# EAGLE design napajeniMOB (EAGLE 6.4)
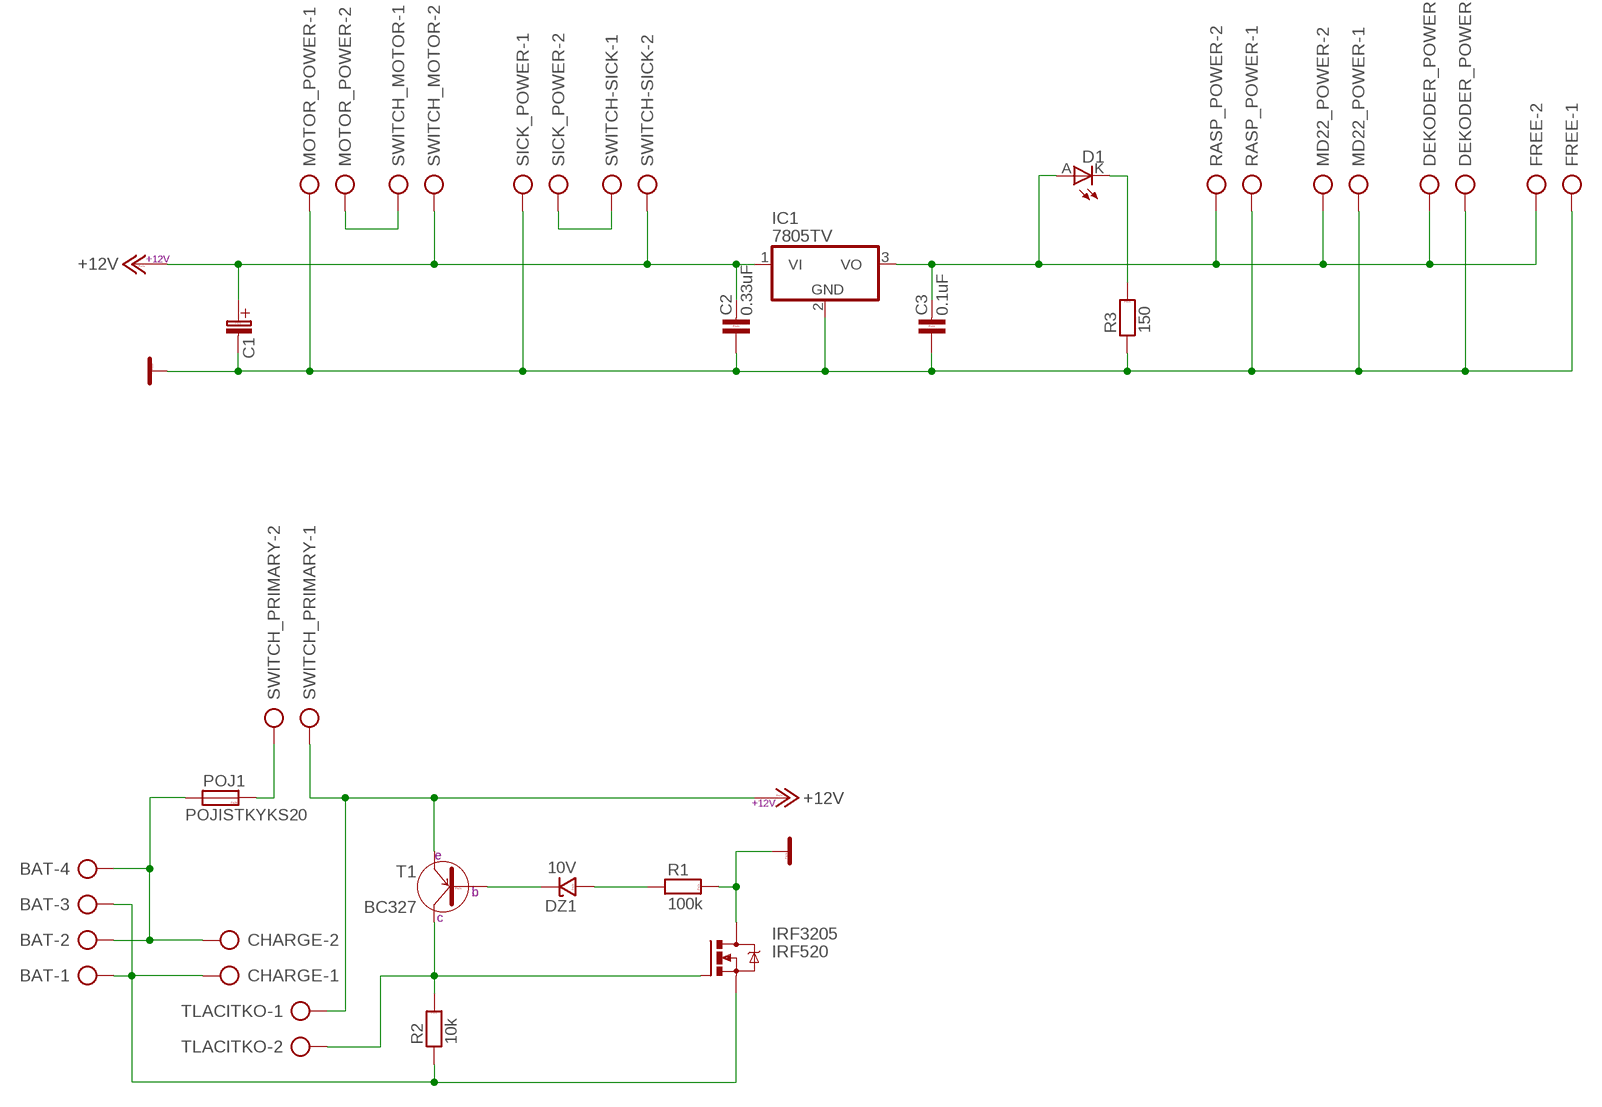
[diagram p0: schematic, sheet 1]

## Parts
BAT  AK500/4  [AK500/4]
C1  C-ELEKTROLYT_7,5+  [C-EL7,5+]
C2  0.33uF  C-KERAMIK_5  [C-5]
C3  0.1uF  C-KERAMIK_5  [C-5]
CHARGE  AK500/2  [AK500/2]
D1  LEDLED5MM  [LED5MM]
DEKODER_POWER  AK500/2  [AK500/2]
DZ1  10V  D-ZENEROVA_2W_BZY  [DO41]
FREE  AK500/2  [AK500/2]
IC1  7805TV  [TO220V]
IRF3205  IRF520  [TO220BV]
MD22_POWER  AK500/2  [AK500/2]
MOTOR_POWER  AK500/2  [AK500/2]
POJ1  POJISTKYKS20  [POJ_KS20]
R1  100k  R_10  [R-10]
R2  10k  R_10  [R-10]
R3  150  R_10  [R-10]
RASP_POWER  AK500/2  [AK500/2]
SICK_POWER  AK500/2  [AK500/2]
SWITCH-SICK  AK500/2  [AK500/2]
SWITCH_MOTOR  AK500/2  [AK500/2]
SWITCH_PRIMARY  AK500/2  [AK500/2]
T1  BC327  [TO-92]
TLACITKO  AK500/2  [AK500/2]

## Nets
+12V: C1.C+(C_EL+) C2.2 IC1.1(VI) SWITCH-SICK.2 SWITCH_MOTOR.2 SWITCH_PRIMARY.1 T1.3(E) TLACITKO.1
GND: C1.C-(C_EL-) C2.1 C3.1 DEKODER_POWER.1 FREE.1 IC1.2(GND) IRF3205.D MD22_POWER.1 MOTOR_POWER.1 R1.2 R3.1 RASP_POWER.1 SICK_POWER.1
GND_BATERIE: BAT.1 BAT.3 CHARGE.1 IRF3205.S R2.1
N$1: DZ1.A R1.1
N$2: BAT.2 BAT.4 CHARGE.2 POJ1.1
N$3: DZ1.K T1.2(B)
N$4: POJ1.2 SWITCH_PRIMARY.2
N$5: IRF3205.G R2.2 T1.1(C) TLACITKO.2
N$6: MOTOR_POWER.2 SWITCH_MOTOR.1
N$7: SICK_POWER.2 SWITCH-SICK.1
N$8: C3.2 D1.A DEKODER_POWER.2 FREE.2 IC1.3(VO) MD22_POWER.2 RASP_POWER.2
N$14: D1.K(C) R3.2

## Library data of the parts
BAT = #Svorkovnice:AK500/4: CONNECTOR
C1 = #PaJa_30:C-ELEKTROLYT: Kondenzator - elektrolyticky
C2 C3 = #PaJa_30:C-KERAMIK: Kondenzator - keramicky
CHARGE DEKODER_POWER FREE MD22_POWER MOTOR_POWER RASP_POWER SICK_POWER SWITCH-SICK SWITCH_MOTOR SWITCH_PRIMARY TLACITKO = #Svorkovnice:AK500/2: CONNECTOR
D1 = #Led:LED
DZ1 = #PaJa_30:D-ZENEROVA: Zenerova dioda
IC1 = linear:78*: Positive VOLTAGE REGULATOR Source: http://cache.national.com/ds/LM/LM78L05.pdf http://www.fairchildsemi.com/ds/LM/LM7805.pdf
IRF3205 = transistor-power:IRF520: HEXFET Power MOSFET
POJ1 = #PaJa_30:POJISTKY: Pojistkove pouzdro
R1-R3 = #PaJa_30:R: Rezistor
T1 = #PaJa_30:BC327: Tranzistor PNP - Univerzalni NF - Ic=0,5A

## Board
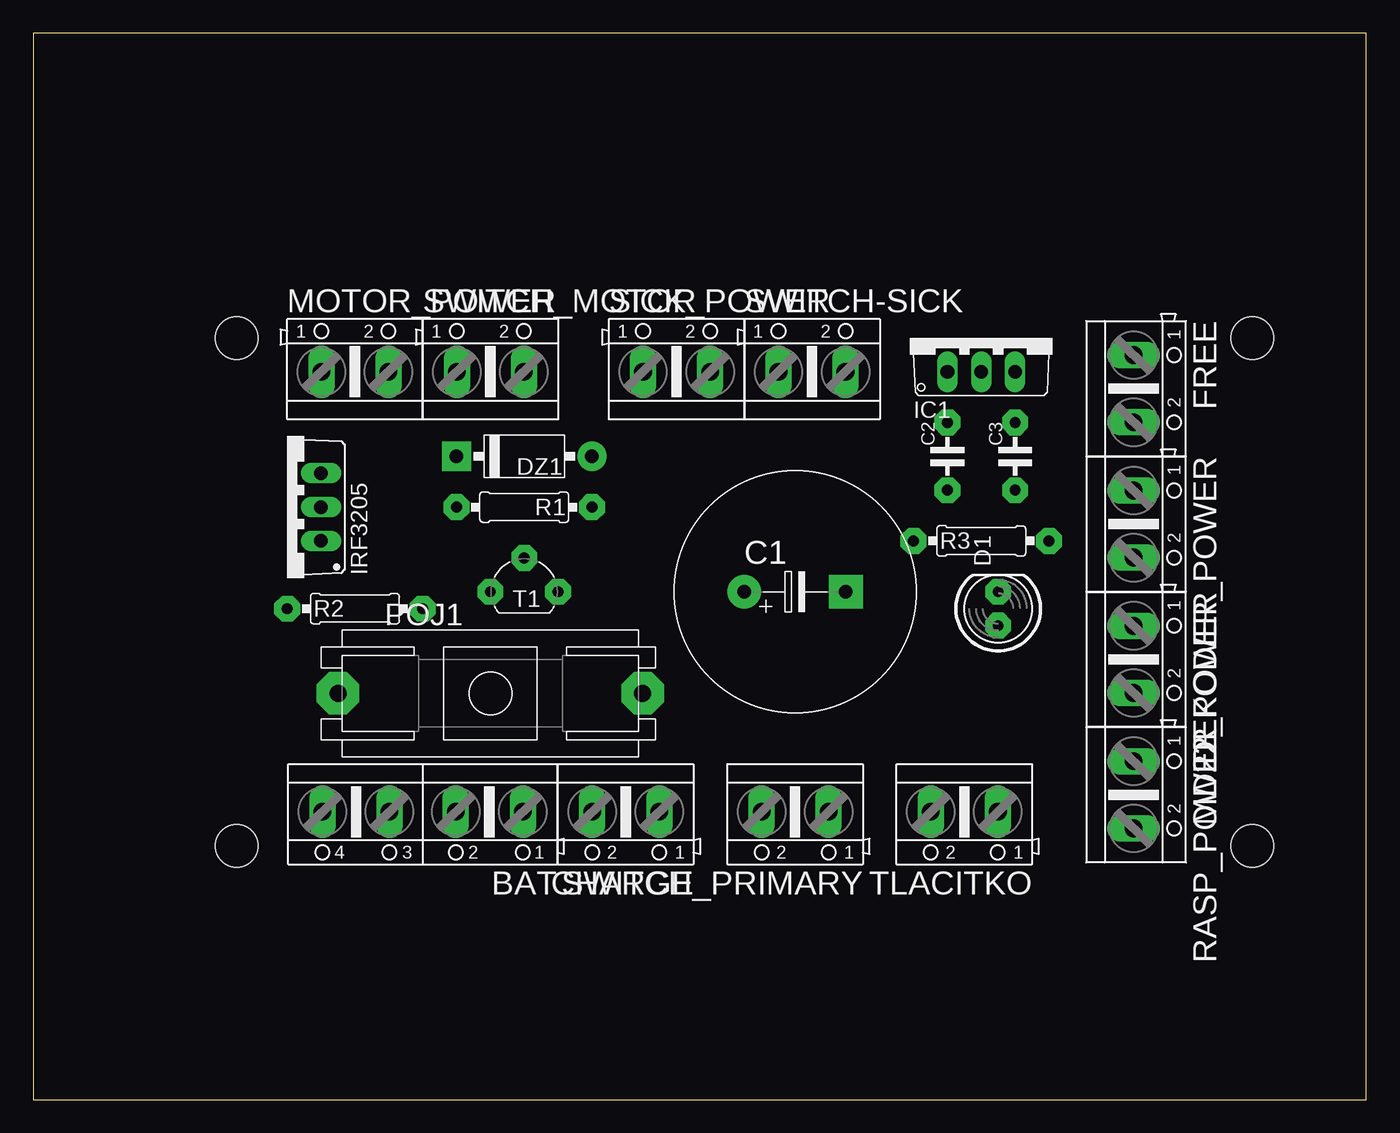
[diagram p1: board, top side]
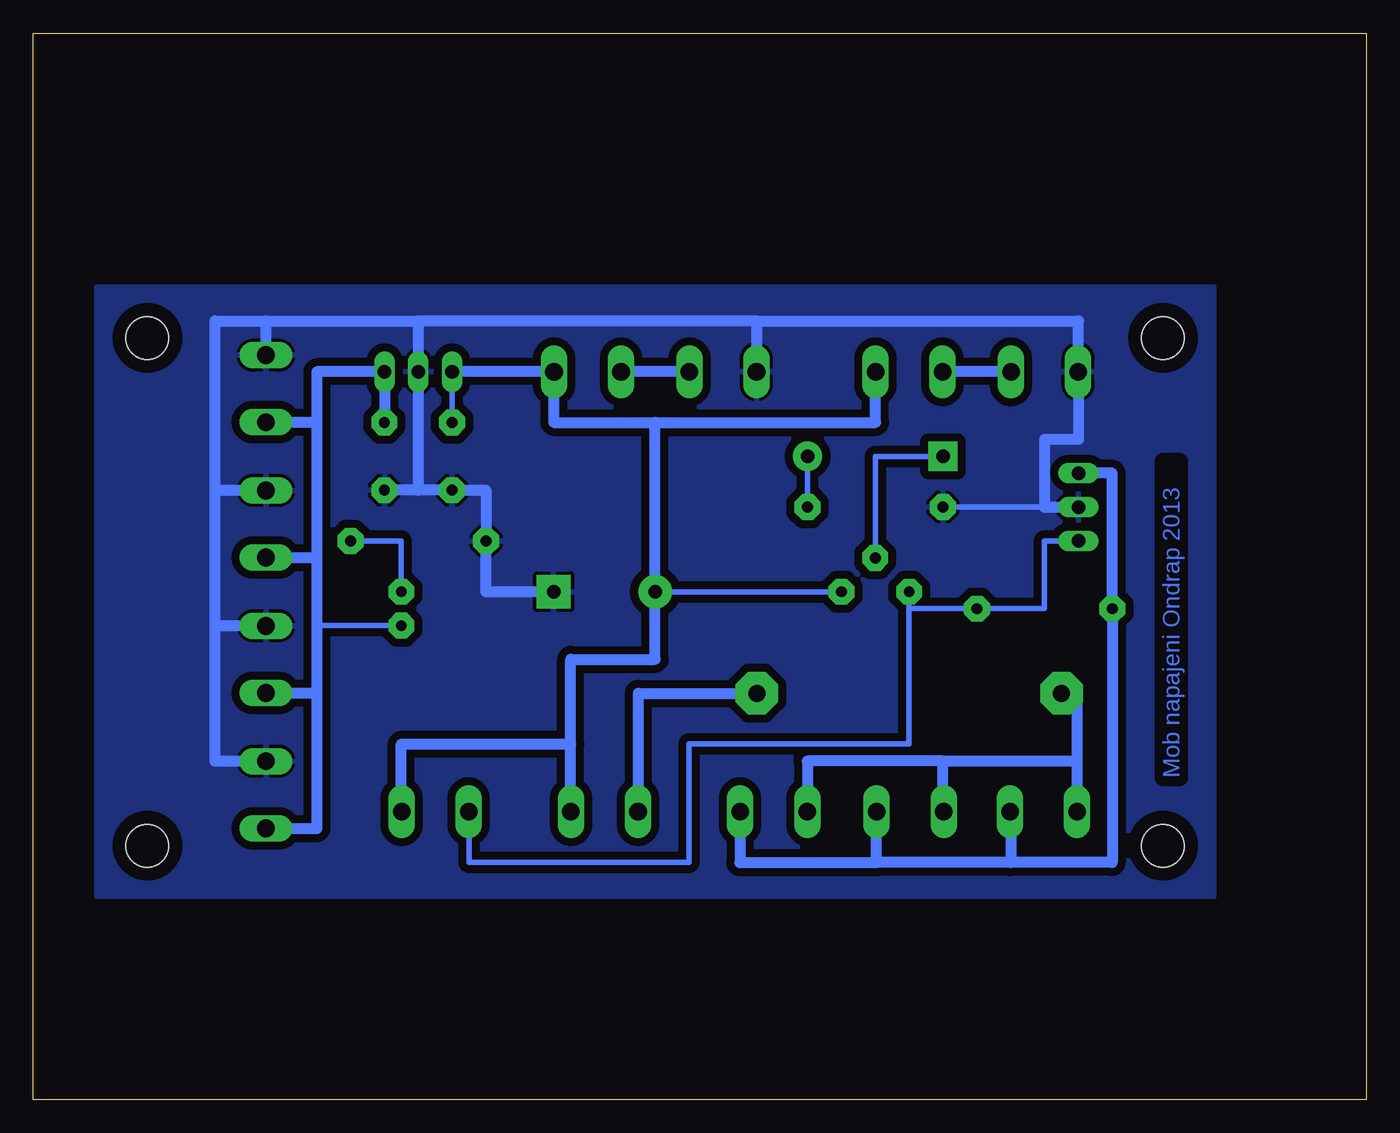
[diagram p2: board, bottom side, seen from below]

Size 100 x 80 mm. Coordinates in mm from the lower left corner, seen from the top.
Outline: 0,0 100,0 100,80 0,80 0,0
Copper layers (1*16): Top 0.035mm / dielectric 1.5mm / Bottom 0.035mm
Design rules "default": minimum track width 10mil, minimum drill 24mil, track to track 8mil, track to pad 8mil, pad to pad 8mil, via to via 8mil, smd to smd 8mil, copper to edge 40mil, drill to drill 8mil, minimum pad ring 10mil, minimum via ring 8mil, stop-mask expansion 4mil, vias tented up to drill 0mil, thermal gap 10mil
Holes 3.2 mm at 15.24,57.15 15.24,19.05 91.44,19.05 91.44,57.15

### Footprints (pad centres in the part's own frame; a part is rotated, then mirrored left to right if it is on the bottom)
AK500/4 = drill 1.321 long: 1 -7.518,0; 2 -2.489,0; 3 2.489,0; 4 7.518,0
C-EL7,5+ = drill 1.016 pad 2.54: C+ -3.81,0 | drill 1.016 pad 2.54 square: C- 3.81,0
C-5 = drill 0.813 pad 1.93 octagon: 1 -2.54,0; 2 2.54,0
AK500/2 = drill 1.321 long: 1 -2.515,0; 2 2.515,0
LED5MM = drill 0.8 pad 1.93 octagon: A -1.27,0; K 1.27,0
DO41 = drill 1.016 pad 2.184: A -5.08,0 | drill 1.016 pad 2.184 square: K 5.08,0
TO220V = drill 1.016 long: 1 -2.54,-2.54; 2 0,-2.54; 3 2.54,-2.54
TO220BV = drill 1.016 long: D 0,-2.54; G -2.54,-2.54; S 2.54,-2.54
POJ_KS20 = drill 1.27 pad 3.2 octagon: 1 -11.43,0; 2 11.43,0
R-10 = drill 0.813 pad 1.93 octagon: 1 -5.08,0; 2 5.08,0
TO-92 = drill 0.813 pad 1.93 octagon: 1 0,2.54; 2 2.54,0; 3 0,-2.54

### Placement (x,y rotation side)
BAT  29.21,21.59 180 top
C1  57.15,38.1 0 top
C2  68.58,48.26 90 top
C3  73.66,48.26 90 top
CHARGE  44.45,21.59 180 top
D1  72.39,36.83 90 top
DEKODER_POWER  82.55,43.18 270 top
DZ1  36.83,48.26 180 top
FREE  82.55,53.34 270 top
IC1  71.12,57.15 0 top
IRF3205  19.05,44.45 90 top
MD22_POWER  82.55,33.02 270 top
MOTOR_POWER  24.13,54.61 0 top
POJ1  34.29,30.48 0 top
R1  36.83,44.45 180 top
R2  24.13,36.83 0 top
R3  71.12,41.91 0 top
RASP_POWER  82.55,22.86 270 top
SICK_POWER  48.26,54.61 0 top
SWITCH-SICK  58.42,54.61 0 top
SWITCH_MOTOR  34.29,54.61 0 top
SWITCH_PRIMARY  57.15,21.59 180 top
T1  36.83,38.1 90 top
TLACITKO  69.85,21.59 180 top

### Tracks (layer width: path | path; a pad name or v marks a point on that pad's centre or on a via)
+12V
  Bottom 0.406: C2.2 IC1.1 | T1.3 C1.C+
  Bottom 0.813: TLACITKO.1 72.39,21.59 72.39,26.67 59.69,26.67 | SWITCH_PRIMARY.1 59.69,21.59 59.69,26.67 | SWITCH-SICK.2 60.96,54.61 | 60.96,54.61 60.96,50.8 53.34,50.8 | 53.34,50.8 36.8,50.8 SWITCH_MOTOR.2 | 53.34,50.8 C1.C+ 53.34,33.02 59.69,33.02 59.69,26.67 | 60.96,54.61 IC1.1
GND
  Bottom 0.406: R1.2 24.13,44.45
  Bottom 0.813: 71.12,45.72 IC1.2 71.12,58.42 | 71.12,45.72 C3.1 | 71.12,45.72 C2.1 66.04,45.72 R3.1 66.04,38.1 C1.C- | IRF3205.D 24.13,44.45 24.13,49.53 21.59,49.53 21.59,54.61 MOTOR_POWER.1 21.61,58.42 | 45.72,58.42 21.61,58.42 | 21.59,58.42 21.61,58.42 | SICK_POWER.1 45.72,54.61 45.72,58.42 | 45.72,58.42 71.12,58.42 | FREE.1 82.55,58.42 | 82.55,58.42 71.12,58.42 | DEKODER_POWER.1 86.36,45.7 | 86.36,45.7 86.36,58.42 82.55,58.42 | MD22_POWER.1 86.36,35.53 | 86.36,35.53 86.36,45.7 | RASP_POWER.1 86.36,25.38 86.36,35.53
  pour Bottom (isolate 0.61): 11.43,60.96 95.25,60.96 95.25,15.24 11.43,15.24
GND_BATERIE
  Bottom 0.813: IRF3205.S 19.05,46.99 R2.1 19.05,17.78 26.67,17.78 | BAT.3 26.67,21.59 26.67,17.78 | 26.67,17.78 36.73,17.78 | 36.73,17.78 BAT.1 | CHARGE.1 46.99,21.59 46.99,17.78 36.73,17.78
N$1
  Bottom 0.406: R1.1 DZ1.A
N$2
  Bottom 0.813: POJ1.1 21.69,30.48 21.69,25.4 | 21.69,25.4 BAT.4 | 31.75,25.4 41.94,25.4 CHARGE.2 | BAT.2 31.75,21.59 31.75,25.4 | 31.75,25.4 21.69,25.4
N$3
  Bottom 0.406: T1.2 36.83,48.26 DZ1.K
N$4
  Bottom 0.813: SWITCH_PRIMARY.2 54.61,21.59 54.61,30.48 POJ1.2
N$5
  Bottom 0.406: IRF3205.G 24.13,41.91 24.13,36.83 R2.2 34.29,36.83 | T1.1 34.29,36.83 | TLACITKO.2 67.31,21.59 67.31,17.78 50.8,17.78 50.8,26.67 34.29,26.67 34.29,36.83
N$6
  Bottom 0.813: MOTOR_POWER.2 SWITCH_MOTOR.1
N$7
  Bottom 0.813: SICK_POWER.2 SWITCH-SICK.1
N$8
  Bottom 0.406: D1.A 78.74,35.56
  Bottom 0.813: C3.2 IC1.3 78.74,54.61 78.74,50.83 | 78.74,50.83 78.74,40.66 | 78.74,40.66 78.74,35.56 78.74,30.5 | 78.74,30.5 78.74,20.32 82.55,20.32 RASP_POWER.2 | FREE.2 78.74,50.83 | DEKODER_POWER.2 78.74,40.66 | MD22_POWER.2 78.74,30.5
N$14
  Bottom 0.406: D1.K 72.39,41.91 R3.2

### Text on the board
Bottom: Mob napajeni Ondrap 2013